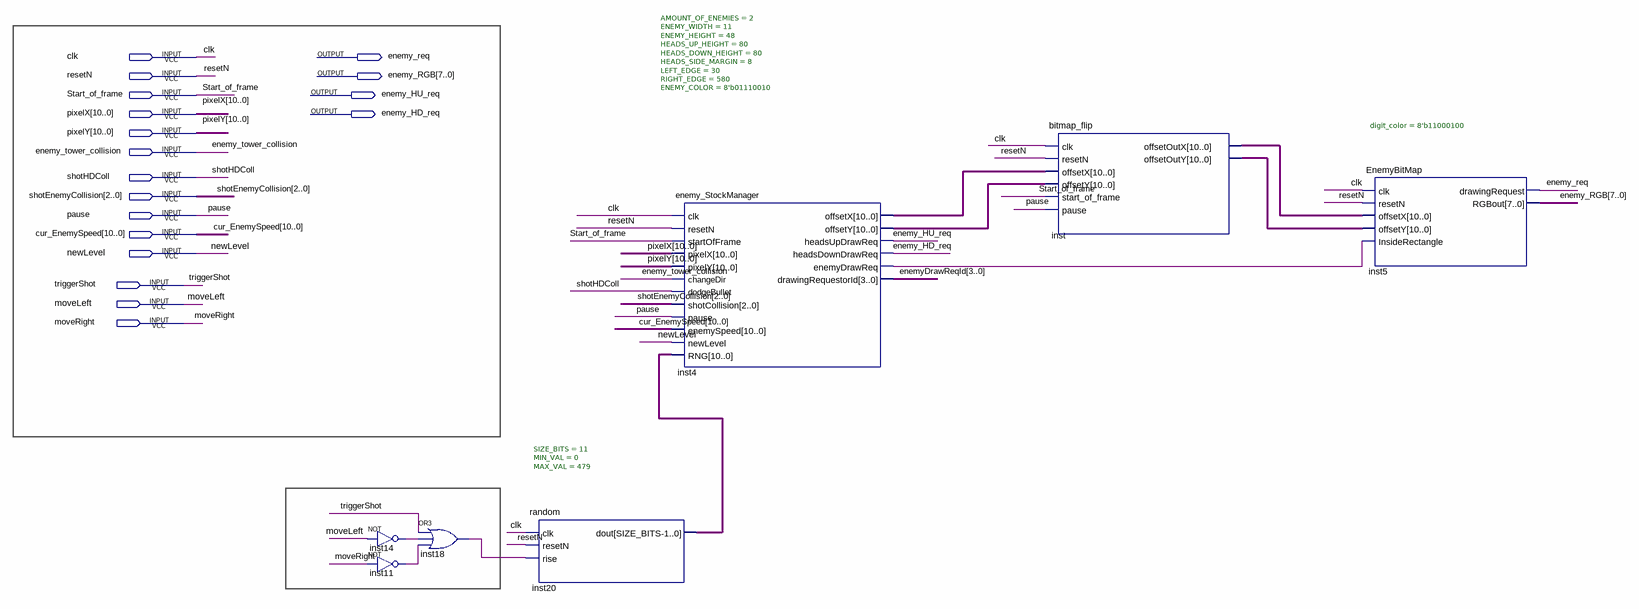
[diagram p0: schematic sheet]
// Quartus schematic TOP_ENEMY.bdf as structural Verilog: 7 symbols, 18 pins
module TOP_ENEMY (
  input  clk,
  input  resetN,
  input  Start_of_frame,
  input  [10:0] pixelX,
  input  [10:0] pixelY,
  input  enemy_tower_collision,
  input  shotHDColl,
  input  [2:0] shotEnemyCollision,
  input  pause,
  input  [10:0] cur_EnemySpeed,
  input  newLevel,
  input  triggerShot,
  input  moveLeft,
  input  moveRight,
  output enemy_req,
  output [7:0] enemy_RGB,
  output enemy_HU_req,
  output enemy_HD_req
);

  wire inst4_enemydrawreq, inst11_out, inst14_out, inst18_out;
  wire [3:0] enemyDrawReqId;
  wire [10:0] inst4_offsetx, inst4_offsety, inst20_dout, inst_offsetoutx, inst_offsetouty;

  not inst14 (inst14_out, moveLeft);
  not inst11 (inst11_out, moveRight);
  or inst18 (inst18_out, triggerShot, inst14_out, inst11_out);
  random #(.SIZE_BITS(11), .MIN_VAL(0), .MAX_VAL(479)) inst20 (
    .clk(clk), .resetN(resetN), .rise(inst18_out), .dout(inst20_dout));
  enemy_StockManager #(.AMOUNT_OF_ENEMIES(2), .ENEMY_WIDTH(11), .ENEMY_HEIGHT(48), .HEADS_UP_HEIGHT(80), .HEADS_DOWN_HEIGHT(80), .HEADS_SIDE_MARGIN(8), .LEFT_EDGE(30), .RIGHT_EDGE(580), .ENEMY_COLOR(8'b01110010)) inst4 (
    .clk(clk), .resetN(resetN), .startOfFrame(Start_of_frame), .pixelX(pixelX), .pixelY(pixelY),
    .changeDir(enemy_tower_collision), .dodgeBullet(shotHDColl), .shotCollision(shotEnemyCollision),
    .pause(pause), .enemySpeed(cur_EnemySpeed), .newLevel(newLevel), .RNG(inst20_dout),
    .offsetX(inst4_offsetx), .offsetY(inst4_offsety), .headsUpDrawReq(enemy_HU_req),
    .headsDownDrawReq(enemy_HD_req), .enemyDrawReq(inst4_enemydrawreq), .drawingRequestorId(enemyDrawReqId));
  bitmap_flip inst (
    .clk(clk), .resetN(resetN), .offsetX(inst4_offsetx), .offsetY(inst4_offsety),
    .start_of_frame(Start_of_frame), .pause(pause), .offsetOutX(inst_offsetoutx), .offsetOutY(inst_offsetouty));
  EnemyBitMap #(.digit_color(8'b11000100)) inst5 (
    .clk(clk), .resetN(resetN), .offsetX(inst_offsetoutx), .offsetY(inst_offsetouty),
    .InsideRectangle(inst4_enemydrawreq), .drawingRequest(enemy_req), .RGBout(enemy_RGB));
endmodule
